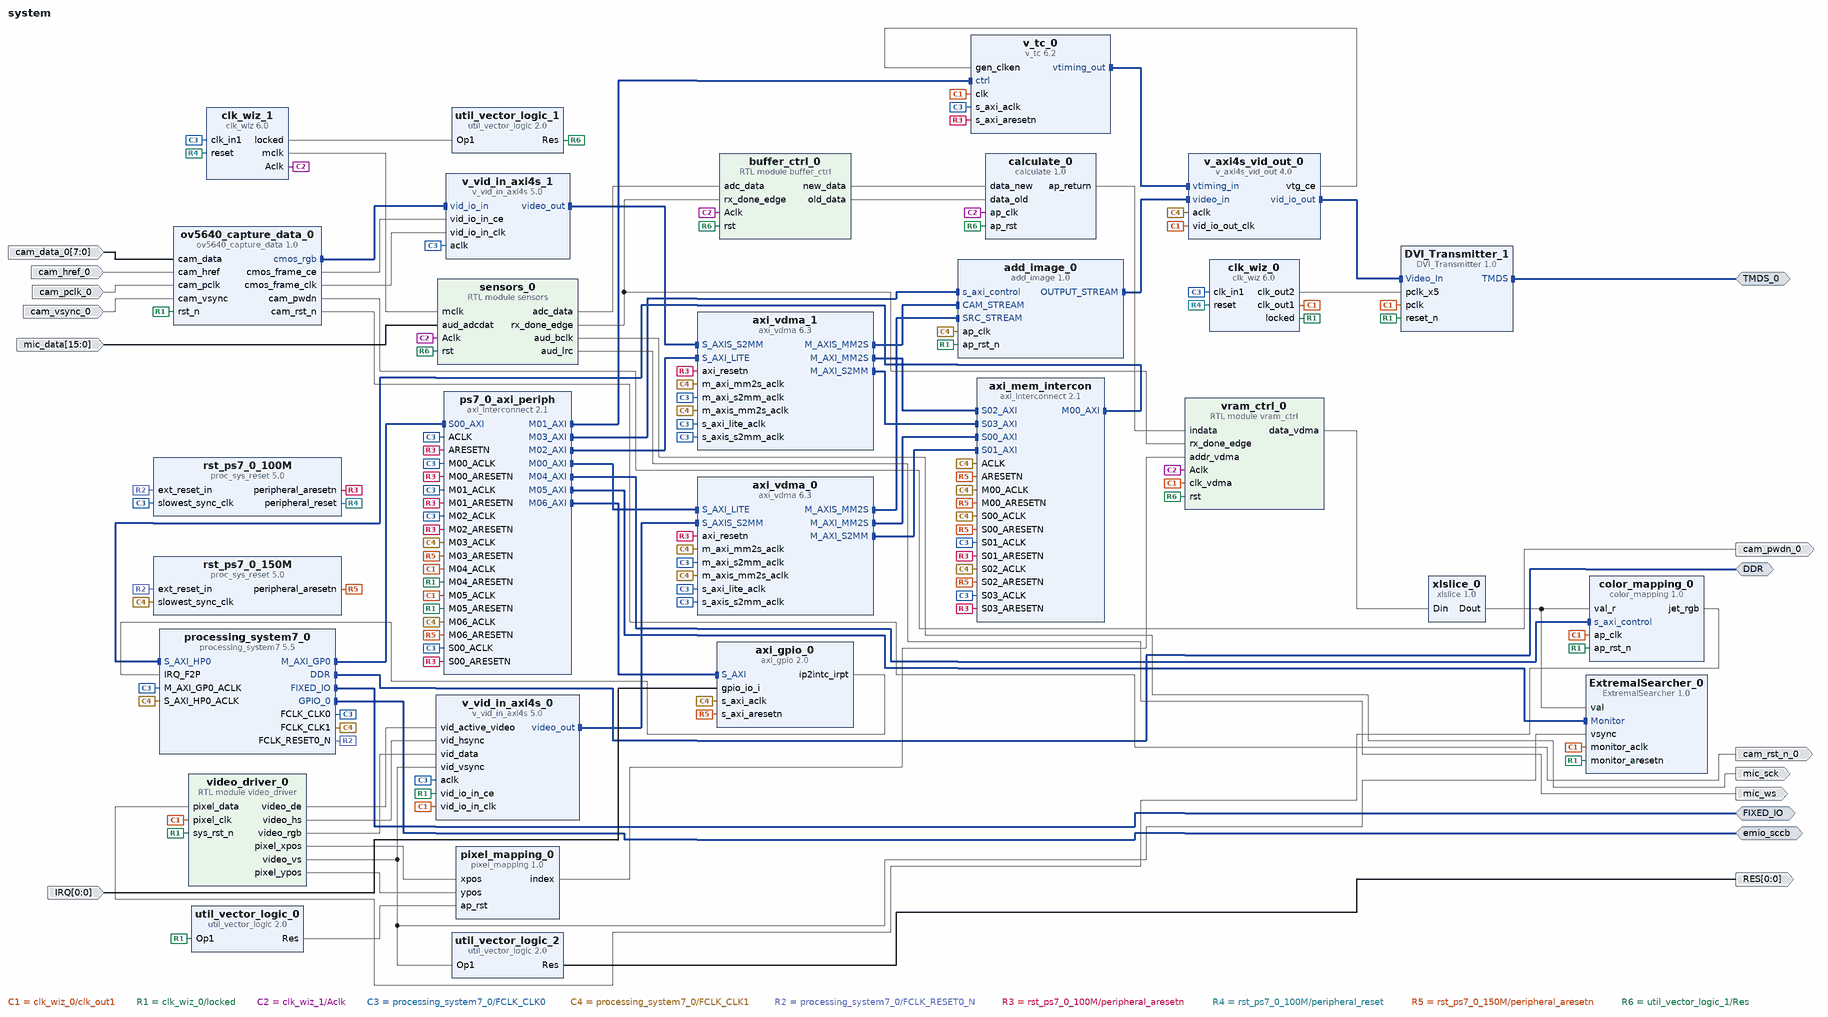
[diagram p0: block diagram of the top level]
# Vivado block design system, xc7z020clg400-2, Vivado 2024.1
create_bd_design system

create_bd_intf_port -mode Master -vlnv xilinx.com:interface:ddrx_rtl:1.0 DDR
create_bd_intf_port -mode Master -vlnv xilinx.com:display_processing_system7:fixedio_rtl:1.0 FIXED_IO
create_bd_intf_port -mode Master -vlnv openedv.com:user:TMDS_rtl:1.0 TMDS_0
create_bd_intf_port -mode Master -vlnv xilinx.com:interface:gpio_rtl:1.0 emio_sccb
create_bd_port -dir O mic_ws
create_bd_port -dir O mic_sck
create_bd_port -dir O -type rst cam_rst_n_0
create_bd_port -dir O cam_pwdn_0
create_bd_port -dir I cam_pclk_0
create_bd_port -dir I cam_vsync_0
create_bd_port -dir I cam_href_0
create_bd_port -dir I -from 7 -to 0 cam_data_0
create_bd_port -dir I -from 15 -to 0 mic_data
create_bd_port -dir I -from 0 -to 0 IRQ
create_bd_port -dir O -from 0 -to 0 RES

create_bd_cell -type ip -vlnv xilinx.com:ip:axi_vdma:6.3 axi_vdma_0
set_property -dict [list \
  CONFIG.c_include_s2mm 1 \
  CONFIG.c_m_axis_mm2s_tdata_width 24 \
  CONFIG.c_mm2s_linebuffer_depth 2048 \
  CONFIG.c_mm2s_max_burst_length 64 \
  CONFIG.c_num_fstores 3 \
  CONFIG.c_s2mm_genlock_mode 2 \
  CONFIG.c_s2mm_linebuffer_depth 2048 \
  CONFIG.c_s2mm_max_burst_length 64 \
] [get_bd_cells axi_vdma_0]
create_bd_cell -type ip -vlnv xilinx.com:ip:clk_wiz:6.0 clk_wiz_0
set_property -dict [list \
  CONFIG.AXI_DRP false \
  CONFIG.CLKOUT1_DRIVES BUFG \
  CONFIG.CLKOUT1_JITTER 337.616 \
  CONFIG.CLKOUT1_PHASE_ERROR 322.999 \
  CONFIG.CLKOUT1_REQUESTED_OUT_FREQ 74.25 \
  CONFIG.CLKOUT2_DRIVES BUFG \
  CONFIG.CLKOUT2_JITTER 258.703 \
  CONFIG.CLKOUT2_PHASE_ERROR 322.999 \
  CONFIG.CLKOUT2_REQUESTED_OUT_FREQ 371.25 \
  CONFIG.CLKOUT2_USED true \
  CONFIG.CLKOUT3_DRIVES BUFG \
  CONFIG.CLKOUT4_DRIVES BUFG \
  CONFIG.CLKOUT5_DRIVES BUFG \
  CONFIG.CLKOUT6_DRIVES BUFG \
  CONFIG.CLKOUT7_DRIVES BUFG \
  CONFIG.MMCM_CLKFBOUT_MULT_F 37.125 \
  CONFIG.MMCM_CLKOUT0_DIVIDE_F 10.000 \
  CONFIG.MMCM_CLKOUT1_DIVIDE 2 \
  CONFIG.MMCM_DIVCLK_DIVIDE 5 \
  CONFIG.NUM_OUT_CLKS 2 \
  CONFIG.PHASE_DUTY_CONFIG false \
  CONFIG.SECONDARY_SOURCE Single_ended_clock_capable_pin \
  CONFIG.USE_DYN_RECONFIG false \
  CONFIG.USE_PHASE_ALIGNMENT false \
] [get_bd_cells clk_wiz_0]
create_bd_cell -type ip -vlnv xilinx.com:ip:processing_system7:5.5 processing_system7_0
set_property -dict [list \
  CONFIG.PCW_APU_PERIPHERAL_FREQMHZ 666.666666 \
  CONFIG.PCW_CPU_CPU_6X4X_MAX_RANGE 767 \
  CONFIG.PCW_ENET0_PERIPHERAL_ENABLE 0 \
  CONFIG.PCW_EN_CLK1_PORT 1 \
  CONFIG.PCW_FPGA0_PERIPHERAL_FREQMHZ 100 \
  CONFIG.PCW_FPGA1_PERIPHERAL_FREQMHZ 150 \
  CONFIG.PCW_FPGA_FCLK1_ENABLE 1 \
  CONFIG.PCW_GPIO_EMIO_GPIO_ENABLE 1 \
  CONFIG.PCW_GPIO_EMIO_GPIO_IO 2 \
  CONFIG.PCW_GPIO_EMIO_GPIO_WIDTH 2 \
  CONFIG.PCW_GPIO_MIO_GPIO_ENABLE 0 \
  CONFIG.PCW_IRQ_F2P_INTR 1 \
  CONFIG.PCW_PERIPHERAL_BOARD_PRESET None \
  CONFIG.PCW_PRESET_BANK1_VOLTAGE {LVCMOS 1.8V} \
  CONFIG.PCW_QSPI_PERIPHERAL_ENABLE 0 \
  CONFIG.PCW_SD0_PERIPHERAL_ENABLE 0 \
  CONFIG.PCW_UART0_PERIPHERAL_ENABLE 1 \
  CONFIG.PCW_UART0_UART0_IO {MIO 14 .. 15} \
  CONFIG.PCW_UART1_PERIPHERAL_ENABLE 0 \
  CONFIG.PCW_UART_PERIPHERAL_FREQMHZ 100 \
  CONFIG.PCW_UIPARAM_DDR_FREQ_MHZ 533.333333 \
  CONFIG.PCW_UIPARAM_DDR_MEMORY_TYPE {DDR 3 (Low Voltage)} \
  CONFIG.PCW_UIPARAM_DDR_PARTNO {MT41K256M16 RE-125} \
  CONFIG.PCW_USB0_PERIPHERAL_ENABLE 0 \
  CONFIG.PCW_USE_FABRIC_INTERRUPT 1 \
  CONFIG.PCW_USE_S_AXI_HP0 1 \
] [get_bd_cells processing_system7_0]
# 344 more settings of processing_system7_0 are not shown: defaults, MIO pin electricals, DDR timing, and values the tool derives
create_bd_cell -type ip -vlnv xilinx.com:ip:proc_sys_reset:5.0 rst_ps7_0_100M
create_bd_cell -type ip -vlnv xilinx.com:ip:v_axi4s_vid_out:4.0 v_axi4s_vid_out_0
set_property -dict {CONFIG.C_HAS_ASYNC_CLK 1} [get_bd_cells v_axi4s_vid_out_0]
create_bd_cell -type ip -vlnv xilinx.com:ip:v_tc:6.2 v_tc_0
set_property -dict [list \
  CONFIG.GEN_HSYNC_POLARITY Low \
  CONFIG.GEN_VSYNC_POLARITY Low \
  CONFIG.enable_detection false \
] [get_bd_cells v_tc_0]
create_bd_cell -type ip -vlnv xilinx.com:ip:v_vid_in_axi4s:5.0 v_vid_in_axi4s_0
set_property -dict {CONFIG.C_HAS_ASYNC_CLK 1} [get_bd_cells v_vid_in_axi4s_0]
create_bd_cell -type ip -vlnv openedv.com:user:DVI_Transmitter:1.0 DVI_Transmitter_1
create_bd_cell -type ip -vlnv xilinx.com:ip:axi_interconnect:2.1 ps7_0_axi_periph
set_property -dict {CONFIG.NUM_MI 7} [get_bd_cells ps7_0_axi_periph]
create_bd_cell -type ip -vlnv xilinx.com:ip:axi_interconnect:2.1 axi_mem_intercon
set_property -dict {CONFIG.NUM_MI 1 CONFIG.NUM_SI 4} [get_bd_cells axi_mem_intercon]
create_bd_cell -type ip -vlnv xilinx.com:ip:proc_sys_reset:5.0 rst_ps7_0_150M
create_bd_cell -type module -reference video_driver video_driver_0
create_bd_cell -type ip -vlnv xilinx.com:hls:pixel_mapping:1.0 pixel_mapping_0
create_bd_cell -type ip -vlnv xilinx.com:ip:util_vector_logic:2.0 util_vector_logic_0
set_property -dict {CONFIG.C_OPERATION not CONFIG.C_SIZE 1} [get_bd_cells util_vector_logic_0]
create_bd_cell -type module -reference vram_ctrl vram_ctrl_0
create_bd_cell -type ip -vlnv xilinx.com:ip:clk_wiz:6.0 clk_wiz_1
set_property -dict [list \
  CONFIG.AXI_DRP false \
  CONFIG.CLKOUT1_DRIVES BUFG \
  CONFIG.CLKOUT1_JITTER 109.776 \
  CONFIG.CLKOUT1_PHASE_ERROR 94.994 \
  CONFIG.CLKOUT1_REQUESTED_OUT_FREQ 210 \
  CONFIG.CLKOUT2_DRIVES BUFG \
  CONFIG.CLKOUT2_JITTER 189.925 \
  CONFIG.CLKOUT2_PHASE_ERROR 94.994 \
  CONFIG.CLKOUT2_REQUESTED_OUT_FREQ 14 \
  CONFIG.CLKOUT2_USED true \
  CONFIG.CLKOUT3_DRIVES BUFG \
  CONFIG.CLKOUT4_DRIVES BUFG \
  CONFIG.CLKOUT5_DRIVES BUFG \
  CONFIG.CLKOUT6_DRIVES BUFG \
  CONFIG.CLKOUT7_DRIVES BUFG \
  CONFIG.CLK_OUT1_PORT Aclk \
  CONFIG.CLK_OUT2_PORT mclk \
  CONFIG.MMCM_CLKFBOUT_MULT_F 10.500 \
  CONFIG.MMCM_CLKOUT0_DIVIDE_F 5.000 \
  CONFIG.MMCM_CLKOUT1_DIVIDE 75 \
  CONFIG.MMCM_DIVCLK_DIVIDE 1 \
  CONFIG.NUM_OUT_CLKS 2 \
  CONFIG.PHASE_DUTY_CONFIG false \
  CONFIG.SECONDARY_SOURCE Single_ended_clock_capable_pin \
  CONFIG.USE_DYN_RECONFIG false \
  CONFIG.USE_PHASE_ALIGNMENT false \
] [get_bd_cells clk_wiz_1]
create_bd_cell -type ip -vlnv xilinx.com:ip:util_vector_logic:2.0 util_vector_logic_1
set_property -dict {CONFIG.C_OPERATION not CONFIG.C_SIZE 1} [get_bd_cells util_vector_logic_1]
create_bd_cell -type module -reference buffer_ctrl buffer_ctrl_0
create_bd_cell -type module -reference sensors sensors_0
create_bd_cell -type ip -vlnv xilinx.com:hls:calculate:1.0 calculate_0
create_bd_cell -type ip -vlnv xilinx.com:ip:v_vid_in_axi4s:5.0 v_vid_in_axi4s_1
set_property -dict {CONFIG.C_HAS_ASYNC_CLK 1} [get_bd_cells v_vid_in_axi4s_1]
create_bd_cell -type ip -vlnv xilinx.com:ip:axi_vdma:6.3 axi_vdma_1
set_property -dict [list \
  CONFIG.c_include_s2mm 1 \
  CONFIG.c_m_axis_mm2s_tdata_width 24 \
  CONFIG.c_mm2s_linebuffer_depth 2048 \
  CONFIG.c_mm2s_max_burst_length 64 \
  CONFIG.c_num_fstores 3 \
  CONFIG.c_s2mm_genlock_mode 2 \
  CONFIG.c_s2mm_linebuffer_depth 2048 \
  CONFIG.c_s2mm_max_burst_length 64 \
] [get_bd_cells axi_vdma_1]
create_bd_cell -type ip -vlnv alientek.com:user:ov5640_capture_data:1.0 ov5640_capture_data_0
create_bd_cell -type ip -vlnv xilinx.com:hls:add_image:1.0 add_image_0
create_bd_cell -type ip -vlnv xilinx.com:hls:color_mapping:1.0 color_mapping_0
create_bd_cell -type ip -vlnv xilinx.com:ip:xlslice:1.0 xlslice_0
set_property -dict {CONFIG.DIN_FROM 51 CONFIG.DIN_TO 28 CONFIG.DIN_WIDTH 64} [get_bd_cells xlslice_0]
create_bd_cell -type ip -vlnv xilinx.com:user:ExtremalSearcher:1.0 ExtremalSearcher_0
create_bd_cell -type ip -vlnv xilinx.com:ip:axi_gpio:2.0 axi_gpio_0
set_property -dict {CONFIG.C_ALL_INPUTS 1 CONFIG.C_GPIO_WIDTH 1 CONFIG.C_INTERRUPT_PRESENT 1} [get_bd_cells axi_gpio_0]
create_bd_cell -type ip -vlnv xilinx.com:ip:util_vector_logic:2.0 util_vector_logic_2
set_property -dict {CONFIG.C_OPERATION not CONFIG.C_SIZE 1} [get_bd_cells util_vector_logic_2]

# ---- connections ----

connect_bd_intf_net [get_bd_intf_ports TMDS_0] [get_bd_intf_pins DVI_Transmitter_1/TMDS]
connect_bd_intf_net [get_bd_intf_pins add_image_0/OUTPUT_STREAM] [get_bd_intf_pins v_axi4s_vid_out_0/video_in]
connect_bd_intf_net [get_bd_intf_pins axi_mem_intercon/M00_AXI] [get_bd_intf_pins processing_system7_0/S_AXI_HP0]
connect_bd_intf_net [get_bd_intf_pins axi_vdma_0/M_AXIS_MM2S] [get_bd_intf_pins add_image_0/SRC_STREAM]
connect_bd_intf_net [get_bd_intf_pins axi_vdma_0/M_AXI_MM2S] [get_bd_intf_pins axi_mem_intercon/S00_AXI]
connect_bd_intf_net [get_bd_intf_pins axi_vdma_0/M_AXI_S2MM] [get_bd_intf_pins axi_mem_intercon/S01_AXI]
connect_bd_intf_net [get_bd_intf_pins axi_vdma_1/M_AXIS_MM2S] [get_bd_intf_pins add_image_0/CAM_STREAM]
connect_bd_intf_net [get_bd_intf_pins axi_vdma_1/M_AXI_MM2S] [get_bd_intf_pins axi_mem_intercon/S02_AXI]
connect_bd_intf_net [get_bd_intf_pins axi_vdma_1/M_AXI_S2MM] [get_bd_intf_pins axi_mem_intercon/S03_AXI]
connect_bd_intf_net [get_bd_intf_pins ov5640_capture_data_0/cmos_rgb] [get_bd_intf_pins v_vid_in_axi4s_1/vid_io_in]
connect_bd_intf_net [get_bd_intf_ports DDR] [get_bd_intf_pins processing_system7_0/DDR]
connect_bd_intf_net [get_bd_intf_ports FIXED_IO] [get_bd_intf_pins processing_system7_0/FIXED_IO]
connect_bd_intf_net [get_bd_intf_ports emio_sccb] [get_bd_intf_pins processing_system7_0/GPIO_0]
connect_bd_intf_net [get_bd_intf_pins processing_system7_0/M_AXI_GP0] [get_bd_intf_pins ps7_0_axi_periph/S00_AXI]
connect_bd_intf_net [get_bd_intf_pins ps7_0_axi_periph/M00_AXI] [get_bd_intf_pins axi_vdma_0/S_AXI_LITE]
connect_bd_intf_net [get_bd_intf_pins ps7_0_axi_periph/M01_AXI] [get_bd_intf_pins v_tc_0/ctrl]
connect_bd_intf_net [get_bd_intf_pins axi_vdma_1/S_AXI_LITE] [get_bd_intf_pins ps7_0_axi_periph/M02_AXI]
connect_bd_intf_net [get_bd_intf_pins add_image_0/s_axi_control] [get_bd_intf_pins ps7_0_axi_periph/M03_AXI]
connect_bd_intf_net [get_bd_intf_pins color_mapping_0/s_axi_control] [get_bd_intf_pins ps7_0_axi_periph/M04_AXI]
connect_bd_intf_net [get_bd_intf_pins ps7_0_axi_periph/M05_AXI] [get_bd_intf_pins ExtremalSearcher_0/Monitor]
connect_bd_intf_net [get_bd_intf_pins ps7_0_axi_periph/M06_AXI] [get_bd_intf_pins axi_gpio_0/S_AXI]
connect_bd_intf_net [get_bd_intf_pins v_axi4s_vid_out_0/vid_io_out] [get_bd_intf_pins DVI_Transmitter_1/Video_In]
connect_bd_intf_net [get_bd_intf_pins v_tc_0/vtiming_out] [get_bd_intf_pins v_axi4s_vid_out_0/vtiming_in]
connect_bd_intf_net [get_bd_intf_pins v_vid_in_axi4s_0/video_out] [get_bd_intf_pins axi_vdma_0/S_AXIS_S2MM]
connect_bd_intf_net [get_bd_intf_pins v_vid_in_axi4s_1/video_out] [get_bd_intf_pins axi_vdma_1/S_AXIS_S2MM]
connect_bd_net [get_bd_pins axi_gpio_0/ip2intc_irpt] [get_bd_pins processing_system7_0/IRQ_F2P]
connect_bd_net [get_bd_pins buffer_ctrl_0/new_data] [get_bd_pins calculate_0/data_new]
connect_bd_net [get_bd_pins buffer_ctrl_0/old_data] [get_bd_pins calculate_0/data_old]
connect_bd_net [get_bd_pins calculate_0/ap_return] [get_bd_pins vram_ctrl_0/indata]
connect_bd_net -net cam_data_0_1 [get_bd_ports cam_data_0] [get_bd_pins ov5640_capture_data_0/cam_data]
connect_bd_net -net cam_href_0_1 [get_bd_ports cam_href_0] [get_bd_pins ov5640_capture_data_0/cam_href]
connect_bd_net -net cam_pclk_0_1 [get_bd_ports cam_pclk_0] [get_bd_pins ov5640_capture_data_0/cam_pclk]
connect_bd_net -net cam_vsync_0_1 [get_bd_ports cam_vsync_0] [get_bd_pins ov5640_capture_data_0/cam_vsync]
connect_bd_net [get_bd_pins clk_wiz_0/clk_out1] \
  [get_bd_pins DVI_Transmitter_1/pclk] [get_bd_pins v_axi4s_vid_out_0/vid_io_out_clk] [get_bd_pins v_tc_0/clk] \
  [get_bd_pins v_vid_in_axi4s_0/vid_io_in_clk] [get_bd_pins ps7_0_axi_periph/M04_ACLK] [get_bd_pins color_mapping_0/ap_clk] \
  [get_bd_pins video_driver_0/pixel_clk] [get_bd_pins vram_ctrl_0/clk_vdma] [get_bd_pins ExtremalSearcher_0/monitor_aclk] \
  [get_bd_pins ps7_0_axi_periph/M05_ACLK]
connect_bd_net [get_bd_pins clk_wiz_0/clk_out2] [get_bd_pins DVI_Transmitter_1/pclk_x5]
connect_bd_net [get_bd_pins clk_wiz_0/locked] \
  [get_bd_pins DVI_Transmitter_1/reset_n] [get_bd_pins util_vector_logic_0/Op1] [get_bd_pins v_vid_in_axi4s_0/vid_io_in_ce] \
  [get_bd_pins add_image_0/ap_rst_n] [get_bd_pins ov5640_capture_data_0/rst_n] [get_bd_pins ps7_0_axi_periph/M04_ARESETN] \
  [get_bd_pins color_mapping_0/ap_rst_n] [get_bd_pins video_driver_0/sys_rst_n] \
  [get_bd_pins ExtremalSearcher_0/monitor_aresetn] [get_bd_pins ps7_0_axi_periph/M05_ARESETN]
connect_bd_net [get_bd_pins clk_wiz_1/Aclk] \
  [get_bd_pins calculate_0/ap_clk] [get_bd_pins sensors_0/Aclk] [get_bd_pins buffer_ctrl_0/Aclk] \
  [get_bd_pins vram_ctrl_0/Aclk]
connect_bd_net [get_bd_pins clk_wiz_1/locked] [get_bd_pins util_vector_logic_1/Op1]
connect_bd_net [get_bd_pins clk_wiz_1/mclk] [get_bd_pins sensors_0/mclk]
connect_bd_net [get_bd_pins color_mapping_0/jet_rgb] [get_bd_pins video_driver_0/pixel_data]
connect_bd_net -net gpio_io_i_0_1 [get_bd_ports IRQ] [get_bd_pins axi_gpio_0/gpio_io_i]
connect_bd_net [get_bd_ports mic_data] [get_bd_pins sensors_0/aud_adcdat]
connect_bd_net [get_bd_pins ov5640_capture_data_0/cam_pwdn] [get_bd_ports cam_pwdn_0]
connect_bd_net [get_bd_pins ov5640_capture_data_0/cam_rst_n] [get_bd_ports cam_rst_n_0]
connect_bd_net [get_bd_pins ov5640_capture_data_0/cmos_frame_ce] [get_bd_pins v_vid_in_axi4s_1/vid_io_in_ce]
connect_bd_net [get_bd_pins ov5640_capture_data_0/cmos_frame_clk] [get_bd_pins v_vid_in_axi4s_1/vid_io_in_clk]
connect_bd_net [get_bd_pins pixel_mapping_0/index] [get_bd_pins vram_ctrl_0/addr_vdma]
connect_bd_net [get_bd_pins processing_system7_0/FCLK_CLK0] \
  [get_bd_pins processing_system7_0/M_AXI_GP0_ACLK] [get_bd_pins axi_mem_intercon/S01_ACLK] \
  [get_bd_pins axi_vdma_0/s_axi_lite_aclk] [get_bd_pins axi_vdma_0/m_axi_s2mm_aclk] [get_bd_pins axi_vdma_0/s_axis_s2mm_aclk] \
  [get_bd_pins clk_wiz_0/clk_in1] [get_bd_pins ps7_0_axi_periph/ACLK] [get_bd_pins ps7_0_axi_periph/S00_ACLK] \
  [get_bd_pins ps7_0_axi_periph/M00_ACLK] [get_bd_pins ps7_0_axi_periph/M01_ACLK] \
  [get_bd_pins rst_ps7_0_100M/slowest_sync_clk] [get_bd_pins v_tc_0/s_axi_aclk] [get_bd_pins v_vid_in_axi4s_0/aclk] \
  [get_bd_pins clk_wiz_1/clk_in1] [get_bd_pins axi_vdma_1/s_axi_lite_aclk] [get_bd_pins axi_vdma_1/m_axi_s2mm_aclk] \
  [get_bd_pins axi_vdma_1/s_axis_s2mm_aclk] [get_bd_pins v_vid_in_axi4s_1/aclk] [get_bd_pins ps7_0_axi_periph/M02_ACLK] \
  [get_bd_pins axi_mem_intercon/S03_ACLK]
connect_bd_net [get_bd_pins processing_system7_0/FCLK_CLK1] \
  [get_bd_pins processing_system7_0/S_AXI_HP0_ACLK] [get_bd_pins axi_mem_intercon/ACLK] \
  [get_bd_pins axi_mem_intercon/S00_ACLK] [get_bd_pins axi_mem_intercon/M00_ACLK] [get_bd_pins axi_vdma_0/m_axi_mm2s_aclk] \
  [get_bd_pins axi_vdma_0/m_axis_mm2s_aclk] [get_bd_pins rst_ps7_0_150M/slowest_sync_clk] \
  [get_bd_pins v_axi4s_vid_out_0/aclk] [get_bd_pins add_image_0/ap_clk] [get_bd_pins axi_vdma_1/m_axi_mm2s_aclk] \
  [get_bd_pins axi_vdma_1/m_axis_mm2s_aclk] [get_bd_pins axi_mem_intercon/S02_ACLK] [get_bd_pins ps7_0_axi_periph/M03_ACLK] \
  [get_bd_pins axi_gpio_0/s_axi_aclk] [get_bd_pins ps7_0_axi_periph/M06_ACLK]
connect_bd_net [get_bd_pins processing_system7_0/FCLK_RESET0_N] [get_bd_pins rst_ps7_0_100M/ext_reset_in] [get_bd_pins rst_ps7_0_150M/ext_reset_in]
connect_bd_net [get_bd_pins rst_ps7_0_100M/peripheral_aresetn] \
  [get_bd_pins axi_mem_intercon/S01_ARESETN] [get_bd_pins axi_vdma_0/axi_resetn] [get_bd_pins ps7_0_axi_periph/ARESETN] \
  [get_bd_pins ps7_0_axi_periph/S00_ARESETN] [get_bd_pins ps7_0_axi_periph/M00_ARESETN] \
  [get_bd_pins ps7_0_axi_periph/M01_ARESETN] [get_bd_pins v_tc_0/s_axi_aresetn] [get_bd_pins axi_vdma_1/axi_resetn] \
  [get_bd_pins ps7_0_axi_periph/M02_ARESETN] [get_bd_pins axi_mem_intercon/S03_ARESETN]
connect_bd_net [get_bd_pins rst_ps7_0_100M/peripheral_reset] [get_bd_pins clk_wiz_0/reset] [get_bd_pins clk_wiz_1/reset]
connect_bd_net [get_bd_pins rst_ps7_0_150M/peripheral_aresetn] \
  [get_bd_pins axi_mem_intercon/ARESETN] [get_bd_pins axi_mem_intercon/S00_ARESETN] \
  [get_bd_pins axi_mem_intercon/M00_ARESETN] [get_bd_pins axi_mem_intercon/S02_ARESETN] \
  [get_bd_pins ps7_0_axi_periph/M03_ARESETN] [get_bd_pins ps7_0_axi_periph/M06_ARESETN] \
  [get_bd_pins axi_gpio_0/s_axi_aresetn]
connect_bd_net [get_bd_pins sensors_0/adc_data] [get_bd_pins buffer_ctrl_0/adc_data]
connect_bd_net [get_bd_pins sensors_0/aud_bclk] [get_bd_ports mic_sck]
connect_bd_net [get_bd_pins sensors_0/aud_lrc] [get_bd_ports mic_ws]
connect_bd_net [get_bd_pins sensors_0/rx_done_edge] [get_bd_pins buffer_ctrl_0/rx_done_edge] [get_bd_pins vram_ctrl_0/rx_done_edge]
connect_bd_net [get_bd_pins util_vector_logic_0/Res] [get_bd_pins pixel_mapping_0/ap_rst]
connect_bd_net [get_bd_pins util_vector_logic_1/Res] \
  [get_bd_pins calculate_0/ap_rst] [get_bd_pins sensors_0/rst] [get_bd_pins buffer_ctrl_0/rst] [get_bd_pins vram_ctrl_0/rst]
connect_bd_net [get_bd_pins util_vector_logic_2/Res] [get_bd_ports RES]
connect_bd_net [get_bd_pins v_axi4s_vid_out_0/vtg_ce] [get_bd_pins v_tc_0/gen_clken]
connect_bd_net [get_bd_pins video_driver_0/pixel_xpos] [get_bd_pins pixel_mapping_0/xpos]
connect_bd_net [get_bd_pins video_driver_0/pixel_ypos] [get_bd_pins pixel_mapping_0/ypos]
connect_bd_net [get_bd_pins video_driver_0/video_de] [get_bd_pins v_vid_in_axi4s_0/vid_active_video]
connect_bd_net [get_bd_pins video_driver_0/video_hs] [get_bd_pins v_vid_in_axi4s_0/vid_hsync]
connect_bd_net [get_bd_pins video_driver_0/video_rgb] [get_bd_pins v_vid_in_axi4s_0/vid_data]
connect_bd_net [get_bd_pins video_driver_0/video_vs] \
  [get_bd_pins v_vid_in_axi4s_0/vid_vsync] [get_bd_pins ExtremalSearcher_0/vsync] [get_bd_pins util_vector_logic_2/Op1]
connect_bd_net [get_bd_pins vram_ctrl_0/data_vdma] [get_bd_pins xlslice_0/Din]
connect_bd_net [get_bd_pins xlslice_0/Dout] [get_bd_pins color_mapping_0/val_r] [get_bd_pins ExtremalSearcher_0/val]

# ---- address map ----
assign_bd_address -offset 0x00000000 -range 1G -target_address_space [get_bd_addr_spaces axi_vdma_0/Data_MM2S] [get_bd_addr_segs processing_system7_0/S_AXI_HP0/HP0_DDR_LOWOCM]
assign_bd_address -offset 0x00000000 -range 1G -target_address_space [get_bd_addr_spaces axi_vdma_0/Data_S2MM] [get_bd_addr_segs processing_system7_0/S_AXI_HP0/HP0_DDR_LOWOCM]
assign_bd_address -offset 0x00000000 -range 1G -target_address_space [get_bd_addr_spaces axi_vdma_1/Data_MM2S] [get_bd_addr_segs processing_system7_0/S_AXI_HP0/HP0_DDR_LOWOCM]
assign_bd_address -offset 0x00000000 -range 1G -target_address_space [get_bd_addr_spaces axi_vdma_1/Data_S2MM] [get_bd_addr_segs processing_system7_0/S_AXI_HP0/HP0_DDR_LOWOCM]
assign_bd_address -offset 0x40000000 -range 64K -target_address_space [get_bd_addr_spaces processing_system7_0/Data] [get_bd_addr_segs add_image_0/s_axi_control/Reg]
assign_bd_address -offset 0x40010000 -range 64K -target_address_space [get_bd_addr_spaces processing_system7_0/Data] [get_bd_addr_segs color_mapping_0/s_axi_control/Reg]
assign_bd_address -offset 0x40020000 -range 64K -target_address_space [get_bd_addr_spaces processing_system7_0/Data] [get_bd_addr_segs axi_gpio_0/S_AXI/Reg]
assign_bd_address -offset 0x43000000 -range 64K -target_address_space [get_bd_addr_spaces processing_system7_0/Data] [get_bd_addr_segs axi_vdma_0/S_AXI_LITE/Reg]
assign_bd_address -offset 0x43C10000 -range 64K -target_address_space [get_bd_addr_spaces processing_system7_0/Data] [get_bd_addr_segs v_tc_0/ctrl/Reg]
assign_bd_address -offset 0x44A00000 -range 64K -target_address_space [get_bd_addr_spaces processing_system7_0/Data] [get_bd_addr_segs axi_vdma_1/S_AXI_LITE/Reg]
assign_bd_address -offset 0x44A10000 -range 64K -target_address_space [get_bd_addr_spaces processing_system7_0/Data] [get_bd_addr_segs ExtremalSearcher_0/Monitor/Monitor_reg]

validate_bd_design
save_bd_design
